# EAGLE schematic audio wattmeter (EAGLE 7.4.0)
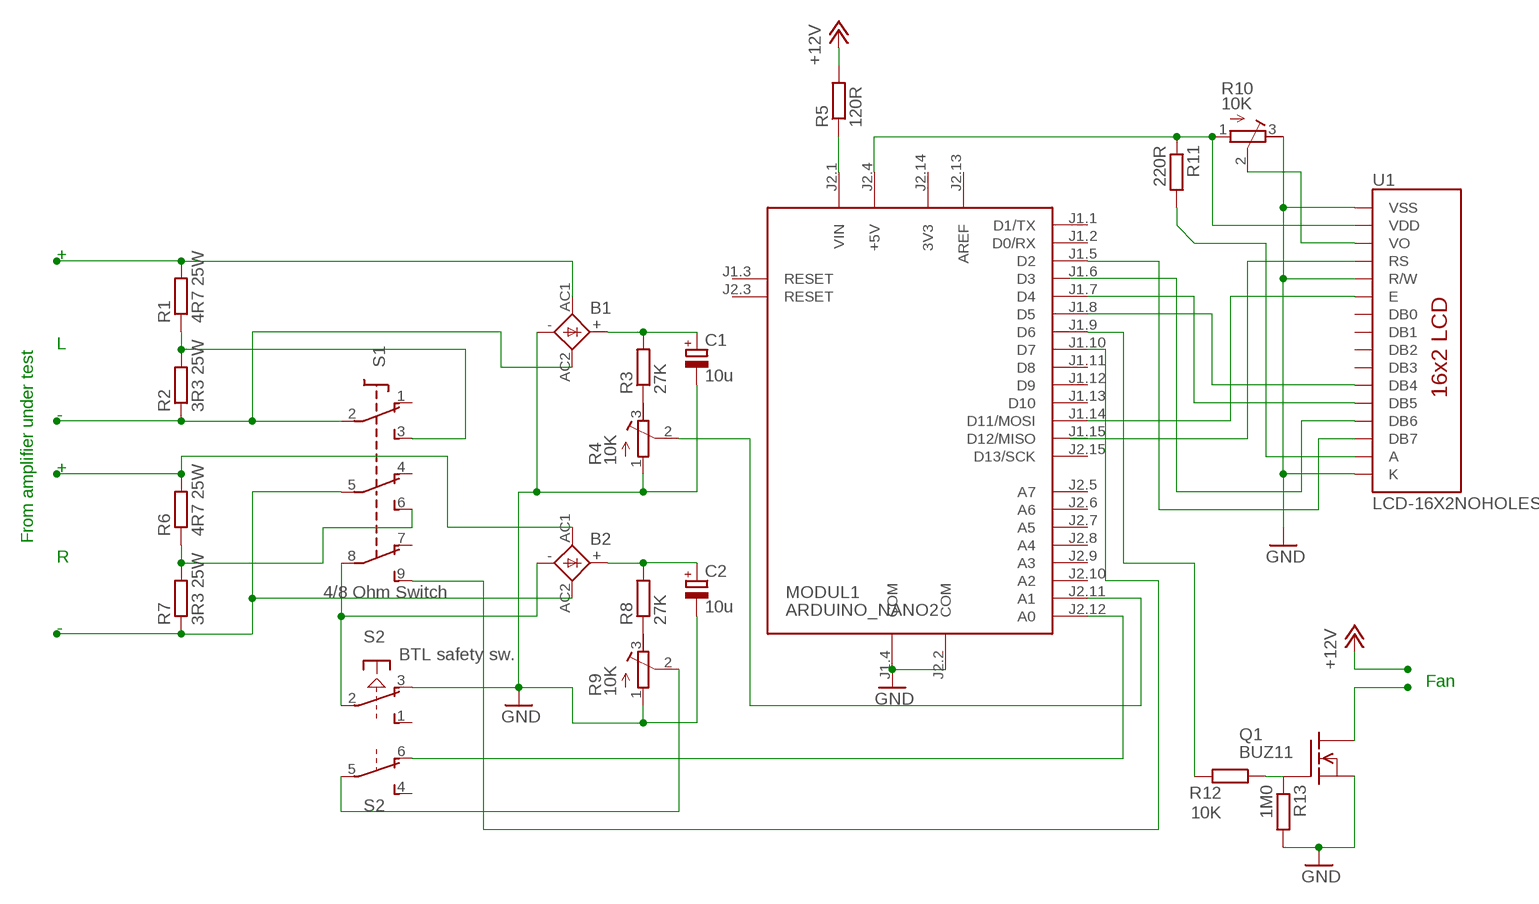
[diagram p0: schematic, sheet 1]

## Parts
B1  FB32  [FB32]
B2  FB32  [FB32]
C1  10u  CPOL-EU139CLL-3W  [139CLL-3W]
C2  10u  CPOL-EU139CLL-3W  [139CLL-3W]
MODUL1  ARDUINO_NANO2  [ARDUINO_NANO2]
Q1  BUZ11  [TO220]
R1  4R7 25W  R-EU_0613/15  [P0613/15]
R2  3R3 25W  R-EU_0613/15  [P0613/15]
R3  27K  R-EU_0613/15  [P0613/15]
R4  10K  R-TRIMM3202  [RTRIM3202]
R5  120R  R-EU_0613/15  [P0613/15]
R6  4R7 25W  R-EU_0613/15  [P0613/15]
R7  3R3 25W  R-EU_0613/15  [P0613/15]
R8  27K  R-EU_0613/15  [P0613/15]
R9  10K  R-TRIMM3202  [RTRIM3202]
R10  10K  R-TRIMM3202  [RTRIM3202]
R11  220R  R-EU_0613/15  [P0613/15]
R12  10K  R-EU_0613/15  [P0613/15]
R13  1M0  R-EU_0613/15  [P0613/15]
S1  4/8 Ohm Switch  3PDT  [3PDT]
S2  BTL safety sw.  PVA2R  [PVA2R]
U1  LCD-16X2NOHOLES  [LCD-16X2_NOHOLES]

## Nets
+12V: R5.2
GND: B1.- C1.- C2.- MODUL1.J1.4(COM) MODUL1.J2.2(COM) Q1.3(S) R4.1(A) R9.1(A) R10.3(E) R13.2 S2.3(1:O) U1.1(VSS) U1.5(R/W) U1.16(K)
N$1: R1.1 R2.2 S1.3(S1)
N$2: B1.AC1 R1.2
N$3: B1.AC2 R2.1 S1.2(P1)
N$4: MODUL1.J2.1(VIN) R5.1
N$5: R6.1 R7.2 S1.6(S2)
N$6: MODUL1.J1.10(D7) S1.9(S3)
N$7: B1.+ C1.+ R3.2
N$8: R3.1 R4.3(E)
N$9: B2.AC1 R6.2
N$10: B2.AC2 R7.1 S1.5(P2)
N$11: MODUL1.J2.11(A1) R4.2(S)
N$12: R9.2(S) S2.5(2:P)
N$13: MODUL1.J2.12(A0) S2.6(2:O)
N$14: B2.+ C2.+ R8.2
N$15: R8.1 R9.3(E)
N$16: B2.- S1.8(P3) S2.2(1:P)
N$17: MODUL1.J1.9(D6) R12.2
N$18: Q1.1(G) R12.1 R13.1
N$19: MODUL1.J2.4(+5V) R10.1(A) R11.1 U1.2(VDD)
N$21: R11.2 U1.15(A)
N$22: Q1.2(D)
N$23: R10.2(S) U1.3(VO)
N$24: U1.4(RS)
N$25: MODUL1.J1.14(D11/MOSI) U1.6(E)
N$26: MODUL1.J1.8(D5) U1.11(DB4)
N$27: MODUL1.J1.7(D4) U1.12(DB5)
N$28: U1.13(DB6)
N$29: MODUL1.J1.5(D2) U1.14(DB7)
Unconnected: MODUL1.J1.1(D1/TX) MODUL1.J1.2(D0/RX) MODUL1.J1.3(RESET) MODUL1.J1.6(D3) MODUL1.J1.11(D8) MODUL1.J1.12(D9) MODUL1.J1.13(D10) MODUL1.J1.15(D12/MISO) MODUL1.J2.3(RESET) MODUL1.J2.5(A7) MODUL1.J2.6(A6) MODUL1.J2.7(A5) MODUL1.J2.8(A4) MODUL1.J2.9(A3) MODUL1.J2.10(A2) MODUL1.J2.15(D13/SCK) S1.1(O1) S1.4(O2) S1.7(O3) S2.1(1:S) S2.4(2:S) U1.7(DB0) U1.8(DB1) U1.9(DB2) U1.10(DB3)

## Notes on the sheet
- +
- From amplifier under test | L
- -
- +
- R
- -
- Fan

## Power pins joined to a net without a drawn wire
3V3: MODUL1.J2.14(3V3)
AREF: MODUL1.J2.13(AREF)

## Library data of the parts
B1 B2 = rectifier:FB32: FAGOR RECTIFIER grid 1 x 10,2 x 7,5 mm
C1 C2 = resistor:CPOL-EU: POLARIZED CAPACITOR, European symbol
MODUL1 = arduino:ARDUINO_NANO2: Arduino Nano2 Auto generated by modulcreator.ulp \;; ANZAHL: 2; MODUL: TRUE; STECKX0: -76200; STECKX1: 76200; STECKY0: 177800; STECKY1: 177800
Q1 = transistor-fet:BUZ11: N-Channel Enhancement MOSFET 50V; 30A; 0,040Ohm
R1-R3 R5-R8 R11-R13 = resistor:R-EU_: RESISTOR, European symbol
R4 R9 R10 = resistor:R-TRIMM: Trimm resistor
S1 = switch:3PDT: 3PDT 9 pin footswitch SF17020F-0302-21R-L Source: 3PDT.jpg
S2 = switch-misc:PVA2R: ITT SWITCH
U1 = SparkFun-Displays:LCD-16X2: Standard text-only 16x2 parallel input LCD